# EAGLE design usbXR (EAGLE 8.3.1)
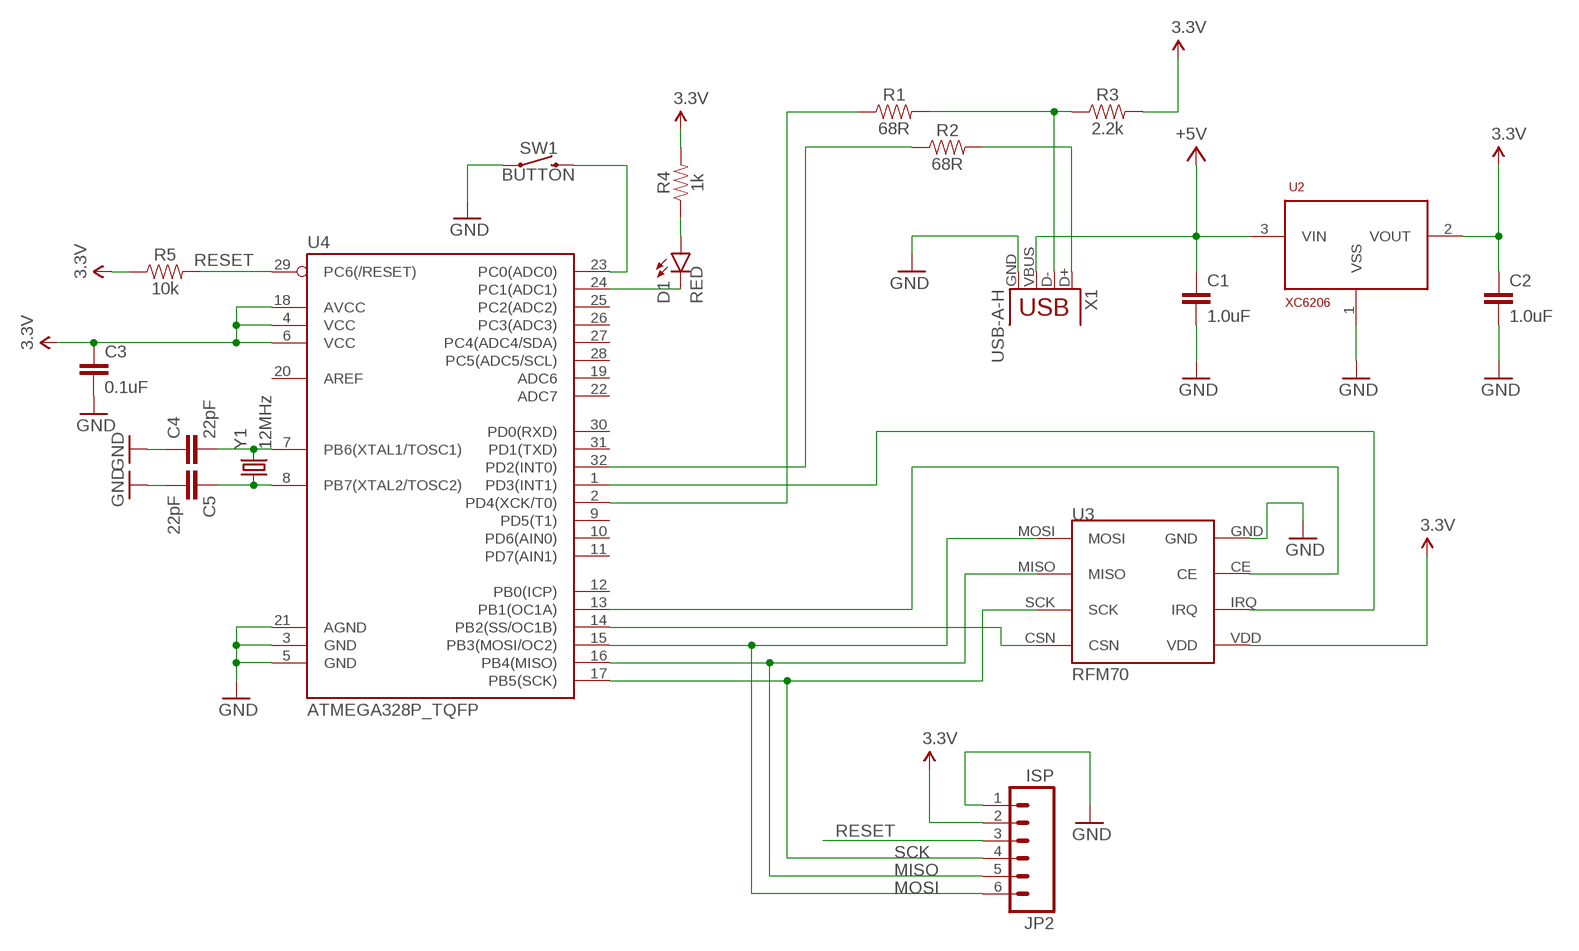
[diagram p0: schematic, sheet 1]

## Parts
C1  1.0uF  1.0UF-0603-16V-10%  [0603]
C2  1.0uF  1.0UF-0603-16V-10%  [0603]
C3  0.1uF  0.1UF-0603-25V-(+80/-20%)  [0603]
C4  22pF  22PF-0603-50V-5%  [0603]
C5  22pF  22PF-0603-50V-5%  [0603]
D1  RED  LED1206  [LED-1206]
JP2  ISP  M061X06-SMD_EDGE_FEMALE  [1X06-SMD_EDGE]
R1  68R  68OHM-0603-1/10W-1%  [0603]
R2  68R  68OHM-0603-1/10W-1%  [0603]
R3  2.2k  2.2KOHM-0603-1/10W-1%  [0603]
R4  1k  1KOHM-0603-1/10W-1%  [0603]
R5  10k  10KOHM-0603-1/10W-1%  [0603]
SW1  BUTTON  TACTILE_SWITCH  [TACTILE_SWITCH_3X4MM]
U2  XC6206  [SOT23-3]
U3  RFM70  RFM70SMD_ONLY  [RFM70_SMD]
U4  ATMEGA328P_TQFP  [TQFP32-08]
X1  USB-A-H  [USB-A-H]
Y1  12MHz  CRYSTALHC49US  [HC49US]

## Nets
3.3V: C2.1 C3.1 JP2.2 R3.2 R4.2 R5.1 U2.2(VOUT) U3.VDD U4.4(VCC) U4.6(VCC) U4.18(AVCC)
+5V: C1.1 U2.3(VIN) X1.VBUS
CE: U3.CE U4.13(PB1(OC1A))
CSN: U3.CSN U4.14(PB2(SS/OC1B))
GND: C1.2 C2.2 C3.2 C4.1 C5.2 JP2.1 SW1.1 U2.1(VSS) U3.GND U4.3(GND) U4.5(GND) U4.21(AGND) X1.GND
IRQ: U3.IRQ U4.1(PD3(INT1))
LED: D1.C U4.24(PC1(ADC1))
MISO: JP2.5 U3.MISO U4.16(PB4(MISO))
MOSI: JP2.6 U3.MOSI U4.15(PB3(MOSI/OC2))
N$5: R1.2 R3.1 X1.D-
N$6: R2.2 X1.D+
N$13: D1.A R4.1
N$22: C4.2 U4.7(PB6(XTAL1/TOSC1)) Y1.2
N$23: C5.1 U4.8(PB7(XTAL2/TOSC2)) Y1.1
RESET: JP2.3 R5.2 U4.29(PC6(/RESET))
SCK: JP2.4 U3.SCK U4.17(PB5(SCK))
SW: SW1.2 U4.23(PC0(ADC0))
USB_DM: R1.1 U4.2(PD4(XCK/T0))
USB_DP: R2.1 U4.32(PD2(INT0))
Unconnected: U4.9(PD5(T1)) U4.10(PD6(AIN0)) U4.11(PD7(AIN1)) U4.12(PB0(ICP)) U4.19(ADC6) U4.20(AREF) U4.22(ADC7) U4.25(PC2(ADC2)) U4.26(PC3(ADC3)) U4.27(PC4(ADC4/SDA)) U4.28(PC5(ADC5/SCL)) U4.30(PD0(RXD)) U4.31(PD1(TXD))

## Library data of the parts
C1 C2 = SparkFun-Capacitors:1.0UF: 1µF ceramic capacitors A capacitor is a passive two-terminal electrical component used to store electrical energy temporarily in an electric field.; PROD_ID: CAP-00868
C3 = SparkFun-Capacitors:0.1UF: 0.1µF ceramic capacitors A capacitor is a passive two-terminal electrical component used to store electrical energy temporarily in an electric field.; PROD_ID: CAP-00810
C4 C5 = SparkFun-Capacitors:22PF: 22pF ceramic capacitors A capacitor is a passive two-terminal electrical component used to store electrical energy temporarily in an electric field.; PROD_ID: CAP-07876
D1 = SparkFun-LED:LED: LEDs Standard schematic elements and footprints for 5mm, 3mm, 1206, and 0603 sized LEDs. 5mm - Spark Fun Electronics SKU : COM-00529 (and others)
JP2 = SparkFun-Connectors:M06: Header 6 Standard 6-pin 0.1" header. Use with straight break away headers (SKU : PRT-00116), right angle break away headers (PRT-00553), swiss pins (PRT-00743), machine pins (PRT-00117), and female headers (PRT-00115). Molex polarized connector foot print use with SKU : PRT-08094 with associated crimp pins and housings. NOTES ON THE VARIANTS LOCK and LOCK_LONGPADS... This footprint was designed to help hold the alignment of a through-hole component (i.e. 6-pin header) while soldering it into place. You may notice that each hole has been shifted either up or down by 0.005 of an inch from it's more standard position (which is a perfectly straight line). This slight alteration caused the pins (the squares in the middle) to touch the edges of the holes. Because they are alternating, it causes a "brace" to hold the component in place. 0.005 has proven to be the perfect amount of "off-center" position when using our standard breakaway headers. Although looks a little odd when you look at the bare footprint, once you have a header in there, the alteration is very hard to notice. Also,if you push a header all the way into place, it is covered up entirely on the bottom side. This idea of altering the position of holes to aid alignment will be further integrated into the Sparkfun Library for other footprints. It can help hold any component with 3 or more connection pins.
R1 R2 = SparkFun-Resistors:68OHM: 68Ω resistor A resistor is a passive two-terminal electrical component that implements electrical resistance as a circuit element. Resistors act to reduce current flow, and, at the same time, act to lower voltage levels within circuits. - Wikipedia
R3 = SparkFun-Resistors:2.2KOHM: 2.2kΩ resistor A resistor is a passive two-terminal electrical component that implements electrical resistance as a circuit element. Resistors act to reduce current flow, and, at the same time, act to lower voltage levels within circuits. - Wikipedia; PROD_ID: RES-08272
R4 = SparkFun-Resistors:1KOHM: 1kΩ resistor A resistor is a passive two-terminal electrical component that implements electrical resistance as a circuit element. Resistors act to reduce current flow, and, at the same time, act to lower voltage levels within circuits. - Wikipedia; PROD_ID: RES-07856
R5 = SparkFun-Resistors:10KOHM: 10kΩ resistor A resistor is a passive two-terminal electrical component that implements electrical resistance as a circuit element. Resistors act to reduce current flow, and, at the same time, act to lower voltage levels within circuits. - Wikipedia; PROD_ID: RES-00824
SW1 = Custom_Parts:TACTILE_SWITCH
U2 = Custom_Parts:XC6206
U3 = RFM70:RFM70: RFM70 short range 2.4GHz RF transceiver module
U4 = SparkFun-IC-Microcontroller:ATMEGA328P_TQFP: Popular 328P in QFP Storefront component: ATmega328 - TQFP <https://www.sparkfun.com/products/13448> (COM-13448) Datasheet <http://www.sparkfun.com/datasheets/Components/SMD/ATMega328.pdf> SparkFun Products SparkFun RedBoard - Programmed with Arduino <https://www.sparkfun.com/products/12757> (DEV-12757) Arduino Pro Mini 328 - 5V/16MHz <https://www.sparkfun.com/products/11113> (DEV-11113) Arduino Pro Mini 328 - 3.3V/8MHz <https://www.sparkfun.com/products/11114> (DEV-11114) SparkFun OpenLog <https://www.sparkfun.com/products/13712> (DEV-13712) SparkFun MicroView - OLED Arduino Module <https://www.sparkfun.com/products/12923> (DEV-12923) SparkFun Digital Sandbox <https://www.sparkfun.com/products/12651> (DEV-12651) SparkFun PicoBoard <https://www.sparkfun.com/products/11888> (WIG-11888) Arduino Fio <https://www.sparkfun.com/products/10116> (DEV-10116) LilyPad Arduino 328 Main Board <https://www.sparkfun.com/products/13342> (DEV-13342) SparkFun RedStick <https://www.sparkfun.com/products/13741> (DEV-13741) LilyPad MP3 <https://www.sparkfun.com/products/11013> (DEV-11013) LilyPad Arduino SimpleSnap <https://www.sparkfun.com/products/10941> (DEV-10941) SparkFun Stepoko <https://www.sparkfun.com/products/13899> (ROB-13899) SparkFun Geiger Counter <https://www.sparkfun.com/products/11345> (SEN-11345) SparkFun EL Sequencer <https://www.sparkfun.com/products/12781> (COM-12781) Arduino Pro 328 - 5V/16MHz <https://www.sparkfun.com/products/10915> (DEV-10915) CryptoCape <https://www.sparkfun.com/products/12773> (DEV-12773) SparkFun IR Thermometer Evaluation Board - MLX90614 <https://www.sparkfun.com/products/10740> (SEN-10740) SparkFun RedBot Mainboard <https://www.sparkfun.com/products/12097> (ROB-12097) Arduino Pro 328 - 3.3V/8MHz <https://www.sparkfun.com/products/10914> (DEV-10914) SparkFun Block for Intel® Edison - Arduino <https://www.sparkfun.com/products/13036> (DEV-13036) SparkFun Simon Says - Surface Mount Soldering Kit <https://www.sparkfun.com/products/10935> (KIT-10935) SparkFun 7-Segment Serial Display - Red <https://www.sparkfun.com/products/11441> (COM-11441) SparkFun 7-Segment Serial Display - White <https://www.sparkfun.com/products/11629> (COM-11629) SparkFun 7-Segment Serial Display - Yellow <https://www.sparkfun.com/products/11443> (COM-11443) SparkFun 7-Segment Serial Display - Kelly Green <https://www.sparkfun.com/products/11440> (COM-11440) SparkFun 7-Segment Serial Display - Blue <https://www.sparkfun.com/products/11442> (COM-11442) SparkFun OpenSegment Serial Display - 20mm (Blue) <https://www.sparkfun.com/products/11647> (COM-11647) SparkFun OpenSegment Serial Display - 20mm (Green) <https://www.sparkfun.com/products/11646> (COM-11646) SparkFun OpenSegment Serial Display - 20mm (White) <https://www.sparkfun.com/products/11648> (COM-11648) SparkFun OpenSegment Serial Display - 20mm (Red) <https://www.sparkfun.com/products/11644> (COM-11644) SparkFun OpenSegment Serial Display - 20mm (Yellow) <https://www.sparkfun.com/products/11645> (COM-11645) SparkFun OpenSegment Shield <https://www.sparkfun.com/products/13190> (DEV-13190); PROD_ID: IC-09069
X1 = SparkFun-Connectors:USB: USB Connectors USB-B-PTH is fully proven SKU : PRT-00139/CONN-08278 USB-miniB is fully proven SKU : PRT-00587 USB-A-PCB is untested. USB-A-H is throughly reviewed, but untested. Spark Fun Electronics SKU : PRT-00437 USB-B-SMT is throughly reviewed, but untested. Needs silkscreen touching up. USB-A-S has not been used/tested USB-MB-H has not been used/tested USB-MICROB has been used. CONN-09505; PROD_ID: CONN-08367
Y1 = SparkFun-FreqCtrl:CRYSTAL: Various standard crystals. Proven footprints.

## Board
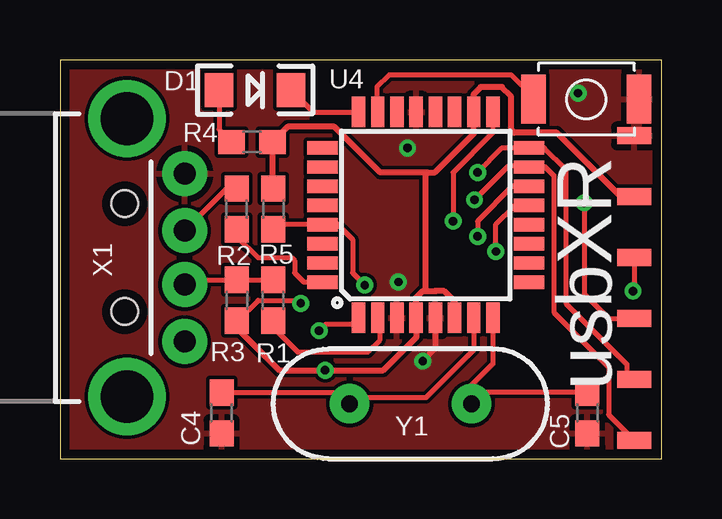
[diagram p1: board, top side]
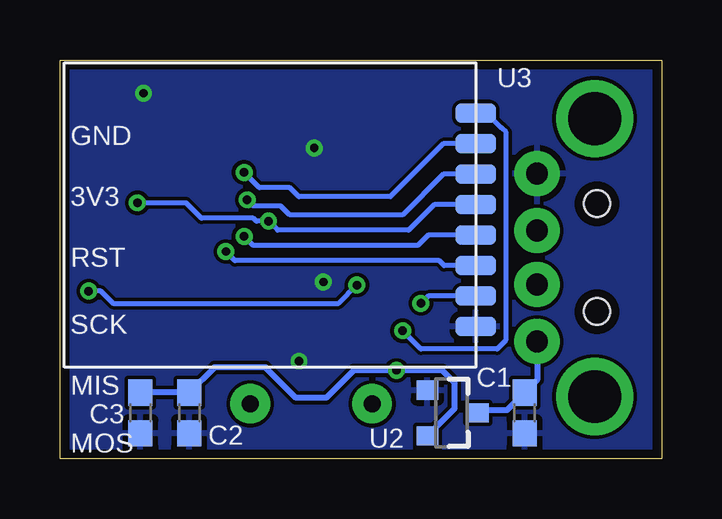
[diagram p2: board, bottom side, seen from below]

Size 25.07 x 16.63 mm. Coordinates in mm from the lower left corner, seen from the top.
Outline: 0,0 25.07,0 25.07,16.63 0,16.63 0,0
Copper layers (1*16): Top 0.0356mm / dielectric 1.5011mm / Bottom 0.0356mm
Design rules "oshpark-2layer *": minimum track width 6mil, minimum drill 13mil, track to track 6mil, track to pad 6mil, pad to pad 6mil, via to via 6mil, smd to smd 6mil, copper to edge 15mil, drill to drill 6mil, minimum pad ring 7mil, minimum via ring 7mil, stop-mask expansion 2.5mil, vias tented up to drill 20mil, thermal gap 10mil

### Footprints (pad centres in the part's own frame; a part is rotated, then mirrored left to right if it is on the bottom)
0603 = smd 1.1 x 1: 1 -0.85,0; 2 0.85,0
LED-1206 = smd 1.2 x 1.4: A -1.5,0; C 1.5,0
1X06-SMD_EDGE = smd 0.711 x 1.422: 1 0,-0.08; 2 2.54,-0.08; 3 5.08,-0.08; 4 7.62,-0.08; 5 10.16,-0.08; 6 12.7,-0.08
TACTILE_SWITCH_3X4MM = smd 1.016 x 2.032: 1 0,0; 2 4.399,0
SOT23-3 = smd 0.8 x 0.9: 1 -0.95,-1; 2 0.95,-1; 3 0,1.1
RFM70_SMD = smd 0.813 x 1.676: CE 4.242,-17.145; CSN 5.512,-17.145; GND 1.702,-17.145; IRQ 10.592,-17.145; MISO 9.322,-17.145; MOSI 8.052,-17.145; SCK 6.782,-17.145; VDD 2.972,-17.145
TQFP32-08 = smd 1.27 x 0.559: 1 -4.293,2.8; 2 -4.293,2; 3 -4.293,1.2; 4 -4.293,0.4; 5 -4.293,-0.4; 6 -4.293,-1.2; 7 -4.293,-2; 8 -4.293,-2.8; 17 4.293,-2.8; 18 4.293,-2; 19 4.293,-1.2; 20 4.293,-0.4; 21 4.293,0.4; 22 4.293,1.2; 23 4.293,2; 24 4.293,2.8 | smd 0.559 x 1.27: 9 -2.8,-4.293; 10 -2,-4.293; 11 -1.2,-4.293; 12 -0.4,-4.293; 13 0.4,-4.293; 14 1.2,-4.293; 15 2,-4.293; 16 2.8,-4.293; 25 2.8,4.293; 26 2,4.293; 27 1.2,4.293; 28 0.4,4.293; 29 -0.4,4.293; 30 -1.2,4.293; 31 -2,4.293; 32 -2.8,4.293
USB-A-H = drill 0.914 pad 1.88: D+ 2.4,1.127; D- 2.4,-1.127; GND 2.4,3.5; VBUS 2.4,-3.5 | drill 2.2: GND2 0,-5.8; GND3 0,5.8 | hole 1.1: -0.1,2.25; -0.1,-2.25
HC49US = drill 0.7 pad 1.651: 1 -2.54,0; 2 2.54,0

### Placement (x,y rotation side)
C1  5.71,1.91 270 bottom
C2  19.68,1.91 270 bottom
C3  21.72,1.91 270 bottom
C4  6.73,1.91 90 top
C5  21.97,1.91 270 top
D1  8.13,15.37 0 top
JP2  24,13.46 270 top
R1  8.89,6.6 90 top
R2  7.37,10.41 90 top
R3  7.37,6.6 270 top
R4  8,13.21 0 top
R5  8.89,10.41 270 top
SW1  24.13,14.99 180 top
U2  8.76,1.91 270 bottom
U3  24.89,3.81 90 bottom
U4  15.24,10.16 90 top
X1  2.79,8.38 0 top
Y1  14.61,2.29 180 top

### Tracks (layer width: path | path; a pad name or v marks a point on that pad's centre or on a via)
3.3V  (via drill 0.35)
  Top 0.203: 8.85,11.3 R5.1 | JP2.2 23.84,10.79 | 15.62,7.02 15.66,6.99 | 7.37,5.33 R3.2 7.41,5.75 8.26,6.6 9.91,6.6 v10.03,6.48
  Top 0.254: 8.85,11.3 R4.2 9.49,13.84 11.43,13.84 13.34,11.94 15.32,11.94 | 15.32,11.94 15.62,11.94 17.24,13.56 U4.18 17.24,15.21 17.53,15.49 18.41,15.49 18.8,15.11 18.8,13.72 18.92,13.59 20.7,13.59 23.5,10.79 23.84,10.79 | 15.24,6.99 15.11,6.99 14.84,6.71 U4.4 14.86,5.85 14.86,5.08 13.46,3.68 v11.05,3.68 9.14,3.68 7.49,5.33 7.37,5.33 | 15.24,6.99 15.66,6.99 16,6.99 16.44,6.55 U4.6 | 15.24,6.99 15.24,11.86 15.32,11.94
  Bottom 0.203: U3.VDD 9.73,6.78 v10.03,6.48
  Bottom 0.254: U2.2 8.64,2.08 8.64,3.17 9.14,3.68 v11.05,3.68 12.83,3.68 13.97,2.54 15.24,2.54 16.51,3.81 18.63,3.81 C2.1 C3.1
+5V
  Bottom 0.203: U2.3 7.54,2.03
  Bottom 0.254: 7.54,2.03 6.44,2.03 C1.1 5.19,3.28 X1.VBUS
CE  (via drill 0.35)
  Top 0.203: v18.16,8.64 18.16,9.78 18.92,10.54 19.51,10.54 U4.13
  Bottom 0.203: U3.CE 9.07,8.05 9.27,8.26 17.78,8.26 v18.16,8.64
CSN  (via drill 0.35)
  Top 0.203: U4.14 18.85,11.36 17.4,9.91 v17.4,9.27
  Bottom 0.203: U3.CSN 9.73,9.32 10.16,8.89 17.02,8.89 v17.4,9.27
GND  (via drill 0.35)
  Top 0.254: U4.5 15.64,4.59 v15.11,4.06
  other vias: 14.48,12.95 21.59,15.24 14.1,7.37
  pour Top: 0,16.51 0,0 25.15,0 25.15,16.64 0.13,16.64
  pour Bottom: 0,16.51 0,0 25.02,0 25.02,16.64 0.13,16.64
IRQ  (via drill 0.35)
  Top 0.203: U4.1 12.16,5.59 11.05,5.59 v10.79,5.33
  Bottom 0.203: 7.27,14.4 U3.IRQ | 7.27,14.4 7.04,14.4 | v10.79,5.33 10.03,4.57 6.86,4.57 6.48,4.95 6.48,13.61 6.66,13.79 7.27,14.4
LED
  Top 0.203: D1.C 10.54,14.45 U4.24
MISO  (via drill 0.35)
  Top 0.203: v17.4,11.94 18.41,12.95 U4.16 20.19,12.96 21.08,12.06 21.08,6.48 23.62,3.94 23.62,3.6 JP2.5 23.88,3.35
  Bottom 0.203: U3.MISO 9.09,13.13 11.3,10.92 15.11,10.92 15.49,11.3 16.76,11.3 v17.4,11.94
MOSI  (via drill 0.35)
  Top 0.203: v17.27,10.79 18.67,12.19 19.42,12.19 | 19.42,12.19 19.5,12.19 U4.15 20.23,12.16 20.57,11.81 20.57,6.1 22.86,3.81 22.86,1.82 JP2.6 | 19.42,12.19 19.55,12.06
  Bottom 0.203: U3.MOSI 9.09,11.86 10.79,10.16 15.49,10.16 15.88,10.54 17.02,10.54 v17.27,10.79
N$5
  Top 0.203: X1.D- 5.39,7.45 R3.1 R1.2
N$6
  Top 0.203: R2.2 6.95,11.26 X1.D+
N$13
  Top 0.203: D1.A 6.63,13.73 R4.1
N$22
  Top 0.203: 11.97,2.38 11.72,2.63 | 11.97,2.38 Y1.2 12.32,2.54 15.24,2.54 17.24,4.54 U4.7 | C4.2 11.6,2.75 11.97,2.38
N$23
  Top 0.203: Y1.1 17.14,3.05 18.04,3.94 U4.8 | 17.49,2.63 Y1.1 | C5.1 17.61,2.75 Y1.1
RESET  (via drill 0.35)
  Top 0.203: 9.21,9.76 R5.2 9.09,9.76 U4.29 10.97,9.78 11.56,9.78 12.19,9.14 12.19,7.75 v12.7,7.24 | JP2.3 23.92,7.03 v23.88,6.99
  Bottom 0.203: v23.88,6.99 23.37,6.99 22.86,6.48 13.46,6.48 v12.7,7.24
SCK  (via drill 0.35)
  Top 0.203: U4.17 18.04,13.6 16.38,11.94 v16.38,9.91 | 23.62,5.71 JP2.4 22.86,5.84 21.84,6.86 v21.84,10.67
  Bottom 0.203: U3.SCK 9.47,10.59 10.54,9.53 16,9.53 v16.38,9.91 16.89,9.91 17.02,10.03 19.18,10.03 19.81,10.67 v21.84,10.67
SW
  Top 0.203: SW1.2 19.73,15.07 18.8,16 13.72,16 13.21,15.49 13.21,14.48 U4.23
USB_DM
  Top 0.203: R1.1 8.89,5.46 9.91,4.45 12.83,4.45 13.34,4.95 13.34,5.77 U4.2
USB_DP
  Top 0.203: R2.1 7.37,9.27 8.26,8.38 9.65,8.38 9.78,8.26 9.78,7.75 10.16,7.37 U4.32

### Text on the board
tNames: usbXR
bNames: GND | 3V3 | RST | SCK | MIS | MOS